# Altium project Flight_Controller.PrjPcb
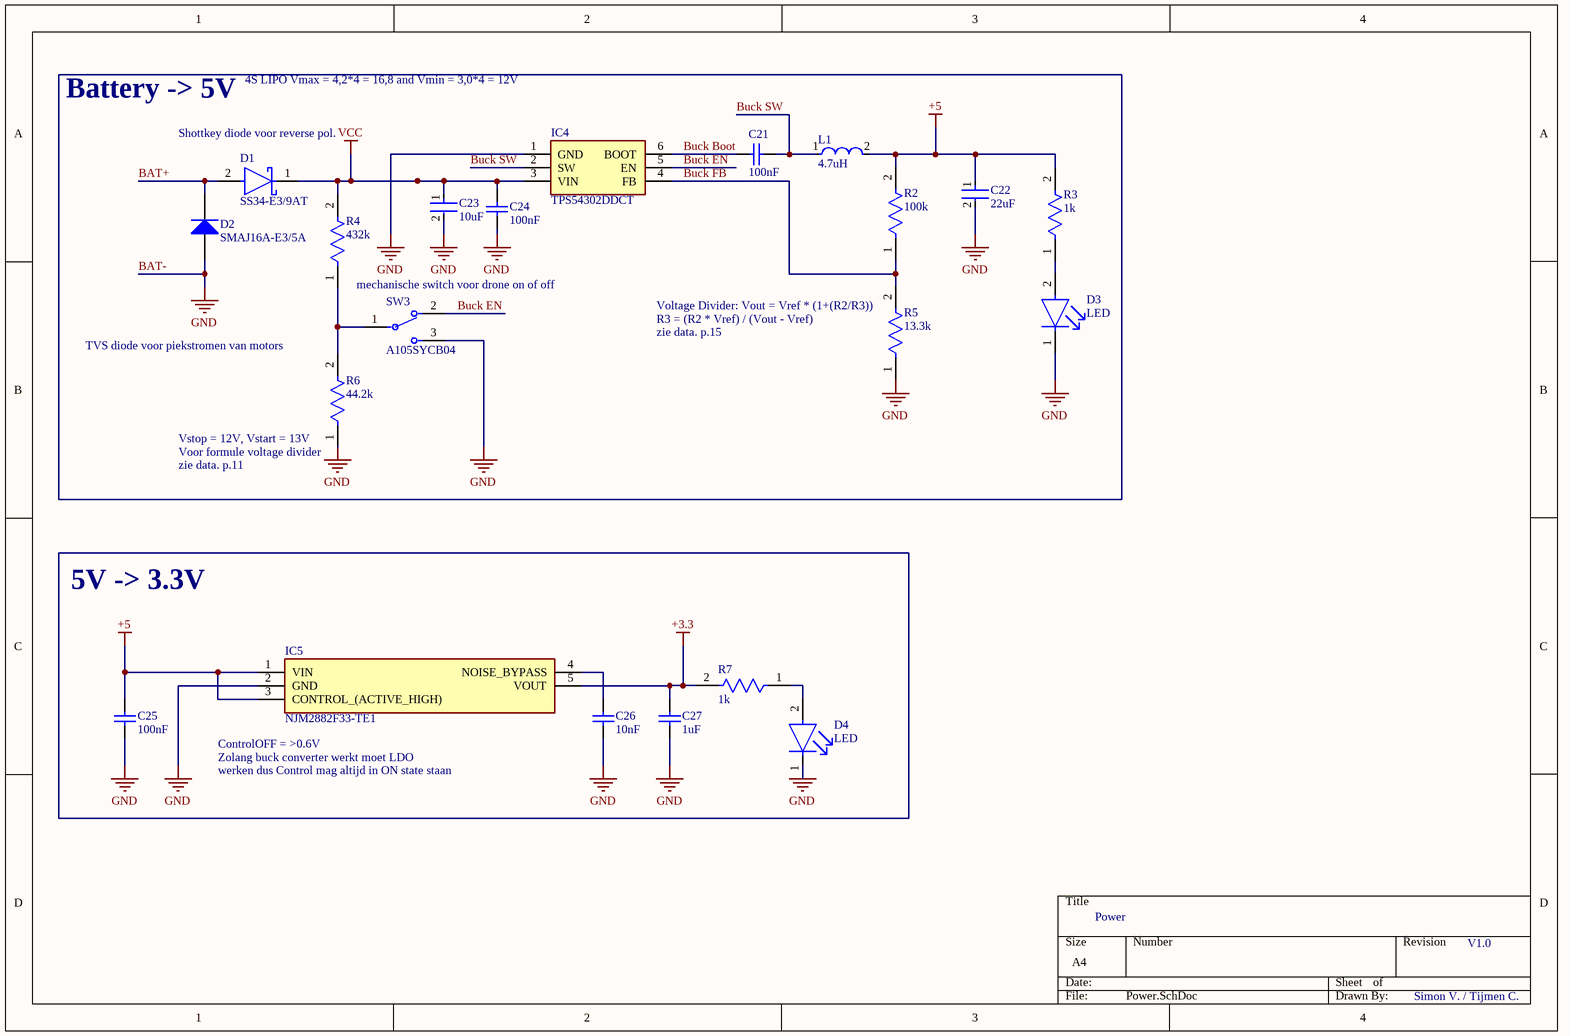
[diagram p0: Power.SchDoc]
5 sheets, 64 parts. Net scope: hierarchical (ports join the sheet entries above them; power ports are global).
Sheets:
  Power.SchDoc
  Root.SchDoc
    U_uController = uController.SchDoc
    U_High Freq = High Freq.SchDoc
    U_Sensors = Sensors.SchDoc

## Sheet Power.SchDoc
size A4; SheetNumber: 1; SheetTotal: 5

### Parts
C21  100nF  [CAPC1608X92X38ML15T08]
C22  22uF  [FP-GRM188-0_2-IPC_A]
C23  10uF  [FP-ZRB18AR61E106ME01L-MFG]
C24  100nF  [CAPC1608X92X38ML15T08]
C25  100nF  [CAPC1608X92X38ML15T08]
C26  10nF  [CAPC1608X92X38LL15T08]
C27  1uF  [CAPC1608X90X35NL15T15]
D1  SS34-E3/9AT  [FP-SMC-MFG]
D2  SMAJ16A-E3/5A  [VISH-DO-214AC-2_M]
D3  LED  [FP-APHD1608LZGCK-MFG]
D4  LED  [FP-APHD1608LZGCK-MFG]
IC4  TPS54302DDCT  [SOT95P280X110-6N]
IC5  NJM2882F33-TE1  [SOT95P280X130-5N]
L1  4.7uH  [FP-IHLP-2020BZ-FP_1_905x2-MFG]
R2  100k  [FP-SR0603-MFG]
R3  1k  [FP-AC0603-IPC_B]
R4  432k  [FP-AC0603-MFG]
R5  13.3k  [FP-AF0603-IPC_A]
R6  44.2k  [FP-CRCW0603-HPe3-IPC_A]
R7  1k  [FP-AC0603-IPC_B]
SW3  A105SYCB04  [FP-A105SYCB04-MFG]

### Nets
+3.3: C27.2 IC5.5(VOUT) R7.2
+5: C22.1 C25.2 IC5.1(VIN) IC5.3(CONTROL_(ACTIVE_HIGH)) L1.2 R2.2 R3.2
BAT-: C22.2 C23.2 C24.1 C25.1 C26.1 C27.1 D2.2(A) D3.1(C) D4.1(C) IC4.1(GND) IC5.2(GND) R5.1 R6.1 SW3.3  [also labelled GND]
VCC: C23.1 C24.2 D1.1(C) IC4.3(VIN) R4.2
BAT+: D1.2(A) D2.1(K)
Buck Boot: C21.2 IC4.6(BOOT)
Buck EN: IC4.5(EN) SW3.2
Buck FB: IC4.4(FB) R2.1 R5.2
Buck SW: C21.1 IC4.2(SW) L1.1
NetC26_2: C26.2 IC5.4(NOISE_BYPASS)
NetD3_2: D3.2(A) R3.1
NetD4_2: D4.2(A) R7.1
NetR4_1: R4.1 R6.2 SW3.1

### Notes on the sheet
- Battery -> 5V
- 4S LIPO Vmax = 4,2*4 = 16,8 and Vmin = 3,0*4 = 12V
- (near D1) Shottkey diode voor reverse pol.
- mechanische switch voor drone on of off
- (near R5) Voltage Divider: Vout = Vref * (1+(R2/R3))
- (near R6) TVS diode voor piekstromen van motors
- zie data. p.15
- (near R5) R3 = (R2 * Vref) / (Vout - Vref)
- (near R6) Vstop = 12V, Vstart = 13V
- (near R6) Voor formule voltage divider
- zie data. p.11
- 5V -> 3.3V
- (near IC5) ControlOFF = >0.6V
- (near IC5) Zolang buck converter werkt moet LDO
- werken dus Control mag altijd in ON state staan
- Power
- V1.0
- Simon V. / Tijmen C.

### Library data of the parts
C21 C24 C25 = CMP-2006-01140-1: Part Number: VJ0603Y104MXXAC; Manufacturer: Vitramon
C22 = CMP-06035-063651-1: Multilayer Ceramic Capacitor 22uF 20% 16V X5R 0603 Paper T/R
C23 = CMP-06035-062385-2: CAP CER 10UF 25V X5R 0603; Tolerance: 20%; Min Operating Temperature: -55°C; Voltage: 25V; Case Code (Imperial): 0603; Case Code (Metric): 1608; Voltage Rating (DC): 25V; Max Operating Temperature: 85°C; Depth: 0.8mm; Thickness: 0.047inch; RoHS Compliant: Yes; Dielectric: X5R; Mount: Surface Mount; Voltage Rating: 25V; Length: 0.063inch; Height: 1mm; Packaging: Cut Tape; Capacitance: 10uF; REACH SVHC: No SVHC; Width: 0.031inch; Case/Package: 0603
C26 = CMP-2006-01201-1: Manufacturer: Vitramon; Part Number: VJ0603Y103JXXAC
C27 = CMP-2006-04534-1: Part Number: 0603YD105MAT2A; Manufacturer: AVX Interconnect / Elco
D1 = CMP-02539-000066-1: DIODE SCHOTTKY 40V 3A DO214AB; Peak Non-Repetitive Surge Current: 100A; Forward Voltage: 500mV; Element Configuration: Single; Max Reverse Current: 500uA; Case/Package: SMC; Radiation Hardening: No; Series: -; Max Surge Current: 100A; RoHS Compliant: Yes; Min Operating Temperature: -55°C; Average Rectified Current: 3A; Max Reverse Leakage Current: 500uA; Package Quantity: 3500; Max Reverse Voltage (DC): 40V; Forward Current: 3A; Packaging: Tape and Reel; Max Operating Temperature: 125°C; Max Repetitive Reverse Voltage (Vrrm): 40V; Number of Pins: 2; Mount: Surface Mount
D2 = CMP-0548-00305-2: Transient Voltage Suppressor, 6.40 to 231 V, 16 V Stand-off Voltage, Uni-Directional, -55 to 155 degC, 2-pin DO-214AC, Pb-Free, Tape and Reel; Manufacturer: Vishay Semiconductor; VWM (V): 16; ID (uA): 1; PPPM (W): 400, 300; VBR Uni-Directional (V): 6.4 to 231; IFSM: 40 A; PackageReference: DO-214AC-2; ComponentLink2Description: Datasheet; Operating Junction and Storage Temperature Range: -55 to 150 degC; PackageDescription: 2-Pin DO-214AC (SMA), Body 4.245 x 2.665 mm; Packing: Tape and Reel; DatasheetVersion: 12/8/2013; ComponentLink1URL: http://www.vishay.com/; Mounting Technology: Surface Mount; RoHS: TRUE; ComponentLink1Description: Manufacturer URL; ComponentLink2URL: http://www.vishay.com/docs/88390/smaj50a.pdf; ComponentLink3Description: Package Specification; PartNumber: SMAJ16A-E3/5A; ComponentLink3URL: http://www.vishay.com/docs/88390/smaj50a.pdf
D3 D4 = CMP-44529-000045-1: LED GREEN CLEAR 1608 SMD, type: APHD1608LZGCK; Test Current: 2mA; Dominant Wavelength: 525nm; Lens Color: Colorless; Luminous Intensity: 180mcd; Viewing Angle: 100°; Forward Voltage: 2.65V; Lens Size: 0.7mm; Lens Style: Round; Mount: Surface Mount; Packaging: Tape and Reel; Lens Transparency: Clear; Height: 0.75mm; Case/Package: 0603; Length: 1.6mm; Case Code (Metric): 1608; Width: 0.8mm; Color: Green; Case Code (Imperial): 0603
IC4 = TPS54302DDCT: Integrated Circuit; Manufacturer_Name: Texas Instruments; Datasheet Link: https://componentsearchengine.com/Datasheets/2/TPS54302DDCT.pdf; Height: 1.1mm; Manufacturer_Part_Number: TPS54302DDCT; Mouser Part Number: 595-TPS54302DDCT; Mouser Price/Stock: https://www.mouser.co.uk/ProductDetail/Texas-Instruments/TPS54302DDCT?qs=zEmsApcVOkXGTx6CMk2KtQ%3D%3D; Arrow Part Number: TPS54302DDCT; Arrow Price/Stock: https://www.arrow.com/en/products/tps54302ddct/texas-instruments?utm_currency=USD&region=nac
IC5 = NJM2882F33-TE1: Integrated Circuit; Manufacturer_Name: New Japan Radio; Datasheet Link: https://datasheet.datasheetarchive.com/originals/distributors/Datasheets_SAMA/4727f49f1a6595e3af9a467a77f12495.pdf; Height: 1.3mm; Manufacturer_Part_Number: NJM2882F33-TE1; Mouser Part Number: 513-NJM2882F33-TE1; Mouser Price/Stock: https://www.mouser.co.uk/ProductDetail/NJR/NJM2882F33-TE1?qs=A8FRqtAK7u9DuEIVjsUa8Q%3D%3D
L1 = CMP-02424-000137-1: Fixed Inductors Commercial High Saturation Series 4.7uH 2.8A 116.6mΩ 20%; Self Resonant Frequency: 28MHz; Test Frequency: 100kHz; Shielding: Shielded; Core Material: Metal; DC Resistance (DCR): 116.6mR; Max DC Current: 3A; Saturation Current: 5A; Radiation Hardening: No; Inductance: 4.7uH; Width: 0.204inch; Packaging: Tape and Reel; Height - Seated (Max): 0.079inch; Height: 2mm; Tolerance: 20%; RMS Current (Irms): 2.8A; Mount: Surface Mount; Military Standard: Not; Termination: SMD/SMT; Min Operating Temperature: -55°C; Max Operating Temperature: 125°C; Case/Package: 2020; Depth: 5.43mm; Package Quantity: 2000; Current Rating: 2.8A; Length: 5.49mm; Inductance Tolerance: 20%
R2 = CMP-03412-000894-1: RES SMD 0603 1/4W 1% 100K OHM; Manufacturer Part Number: SR0603FR-7T100KL; Manufacturer: Yageo; Tolerance: 0.01; Voltage Rating: 75V; Value: 100KΩ; Power Rating: 0.25W; Automotive Grade: Grade 0; Ipc Land Pattern Name: RESC16080X45; Digikey Description: RES SMD 0603 1/4W 1% 100K OHM; Device Class L3: Chip SMD Resistors; Octopart: https://octopart.com/sr0603fr-7t100kl-yageo-91478071; Lead Free: Yes; RoHS: TRUE; Series: SR; Device Class L1: Passive Components; ComponentLink2URL: http://www.yageo.com/documents/recent/PYu-SR_D_F%20tol_RoHS_L_3.pdf; ComponentLink2Description: Datasheet; Automotive: Yes; Category: Res; Temperature Range High: +155°C; Height: 0.55mm; Composition: Thick Film; Resistance: 100KΩ; Temperature Range Low: -55°C; Footprint Url: http://www.yageo.com/exep/pages/download/literatures/PYu-R_Mount_10.pdf; Device Class L2: Resistors; Temperature: -55°C to +155°C; Package: SR0603
R3 R7 = CMP-03412-047577-1: RES 1kΩ 1.00% 0.2W 0603
R4 = CMP-03412-010825-2: RES 432KΩ 1.00% 0.1W 0603; Resistance: 432kR; Temperature Coefficient: 100ppm/°C; Tolerance: 1%; Max Power Dissipation: 100mW; Voltage Rating: 50V; Case Code (Imperial): 0603; Max Operating Temperature: 155°C; Packaging: Tape and Reel; Case/Package: 0603; Min Operating Temperature: -55°C; Height: 0.022inch; Width: 0.8mm; Number of Terminations: 2; Resistor Type: Thick Film; Series: AC; Features: Moisture Resistant; Case Code (Metric): 1608; Length: 0.063inch; Power Rating: 100mW; RoHS Compliant: Yes; Termination: SMD/SMT
R5 = CMP-03412-046877-1: Anti-Sulfurated Chip Resistors Automotive Grade 13.3kΩ 1% 100ppm/°C 0603; Resistance: 13.3kR; Max Power Dissipation: 100mW; Resistor Type: Thick Film; Min Operating Temperature: -55°C; Number of Terminations: 2; Temperature Coefficient: 100ppm/°C; Height: 0.022inch; Case/Package: 0603; Max Operating Temperature: 155°C; Series: AF; Tolerance: 1%; Length: 0.063inch; RoHS Compliant: Yes; Packaging: Tape and Reel; Width: 0.031inch; Features: Moisture Resistant
R6 = CMP-02407-008692-1: RES Thick Film, 44.2kΩ, 1%, 0.33W, 100ppm/°C, 0603; Resistance: 44.2kR; Max Power Dissipation: 250mW; Length: 0.063inch; Contact Plating: Tin; Height: 0.022inch; Composition: Thick Film; Temperature Coefficient: 100ppm/°C; Termination: Wraparound; Mount: Surface Mount; Package Quantity: 5000; Lead Free: Lead Free; Case/Package: 0603; Width: 0.033inch; Packaging: Tape and Reel; Power Rating: 250mW; Max Operating Temperature: 155°C; Number of Terminations: 2; Features: Automotive AEC-Q200; Tolerance: 1%; Min Operating Temperature: -55°C
SW3 = CMP-03408-000016-1: SWITCH TOGGLE SPDT 0.4VA 20V; Power Rating: 400mW; Insulation Resistance: 30MR; Actuator Length: 10.41mm; Illumination Type: Illuminated; Contact Resistance: 10mR; Contact Current Rating: 400mA; Actuator Material: Phenolic; Contact Material: Copper; Termination: Solder; Throw Configuration: SPDT; Contact Plating: Gold; REACH SVHC: No SVHC; Series: Gemini A; Mount: Bushing; Package Quantity: 100; Voltage Rating (AC): 20V; Min Operating Temperature: -30°C; Max Voltage Rating (DC): 20V; Max Operating Temperature: 85°C; Flammability Rating: UL94 V-0; RoHS Compliant: Yes

## Sheet Root.SchDoc
size A4; SheetNumber: 2; SheetTotal: 6
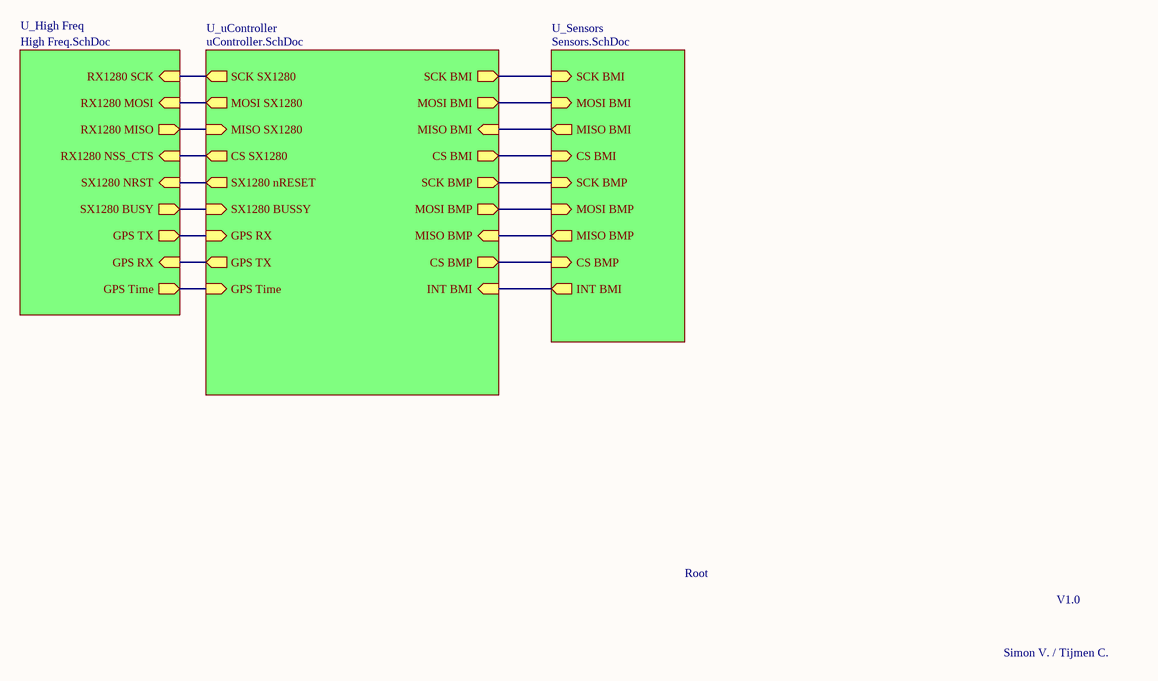
[diagram p1: Root.SchDoc]

### Sub-sheets
U_High Freq = High Freq.SchDoc: SX1280 BUSY (out), SX1280 NRST (in), RX1280 MISO (out), RX1280 MOSI (in), RX1280 SCK (in), RX1280 NSS_CTS (in), GPS RX (in), GPS TX (out), GPS Time (out)
U_Sensors = Sensors.SchDoc: MOSI BMI (in), SCK BMI (in), CS BMI (in), MISO BMI (out), MOSI BMP (in), SCK BMP (in), CS BMP (in), MISO BMP (out), INT BMI (out)
U_uController = uController.SchDoc: CS BMI (out), CS SX1280 (out), MISO BMI (in), MISO SX1280 (in), MOSI BMI (out), MOSI SX1280 (out), SCK BMI (out), SCK SX1280 (out), CS BMP (out), MISO BMP (in), MOSI BMP (out), SCK BMP (out), GPS Time (in), SX1280 nRESET (out), SX1280 BUSSY (in), GPS RX (in), GPS TX (out), INT BMI (in)

### Nets
CS BMI: sheet U_uController/CS BMI, sheet U_Sensors/CS BMI
CS BMP: sheet U_uController/CS BMP, sheet U_Sensors/CS BMP
CS SX1280: sheet U_uController/CS SX1280, sheet U_High Freq/RX1280 NSS_CTS
DAN-F10N RX: sheet U_uController/GPS TX, sheet U_High Freq/GPS RX
DAN-F10N TX: sheet U_uController/GPS RX, sheet U_High Freq/GPS TX
GPS Time: sheet U_uController/GPS Time, sheet U_High Freq/GPS Time
INT BMI: sheet U_uController/INT BMI, sheet U_Sensors/INT BMI
MISO BMI: sheet U_uController/MISO BMI, sheet U_Sensors/MISO BMI
MISO BMP: sheet U_uController/MISO BMP, sheet U_Sensors/MISO BMP
MISO SX1280: sheet U_uController/MISO SX1280, sheet U_High Freq/RX1280 MISO
MOSI BMI: sheet U_uController/MOSI BMI, sheet U_Sensors/MOSI BMI
MOSI BMP: sheet U_uController/MOSI BMP, sheet U_Sensors/MOSI BMP
MOSI SX1280: sheet U_uController/MOSI SX1280, sheet U_High Freq/RX1280 MOSI
RX1280 SCK: sheet U_uController/SCK SX1280, sheet U_High Freq/RX1280 SCK
SCK BMI: sheet U_uController/SCK BMI, sheet U_Sensors/SCK BMI
SCK BMP: sheet U_uController/SCK BMP, sheet U_Sensors/SCK BMP
SX1280 BUSSY: sheet U_uController/SX1280 BUSSY, sheet U_High Freq/SX1280 BUSY
SX1280 nReset: sheet U_uController/SX1280 nRESET, sheet U_High Freq/SX1280 NRST

### Notes on the sheet
- Root
- V1.0
- Simon V. / Tijmen C.

## Sheet uController.SchDoc
size A3; SheetNumber: 3; SheetTotal: 5
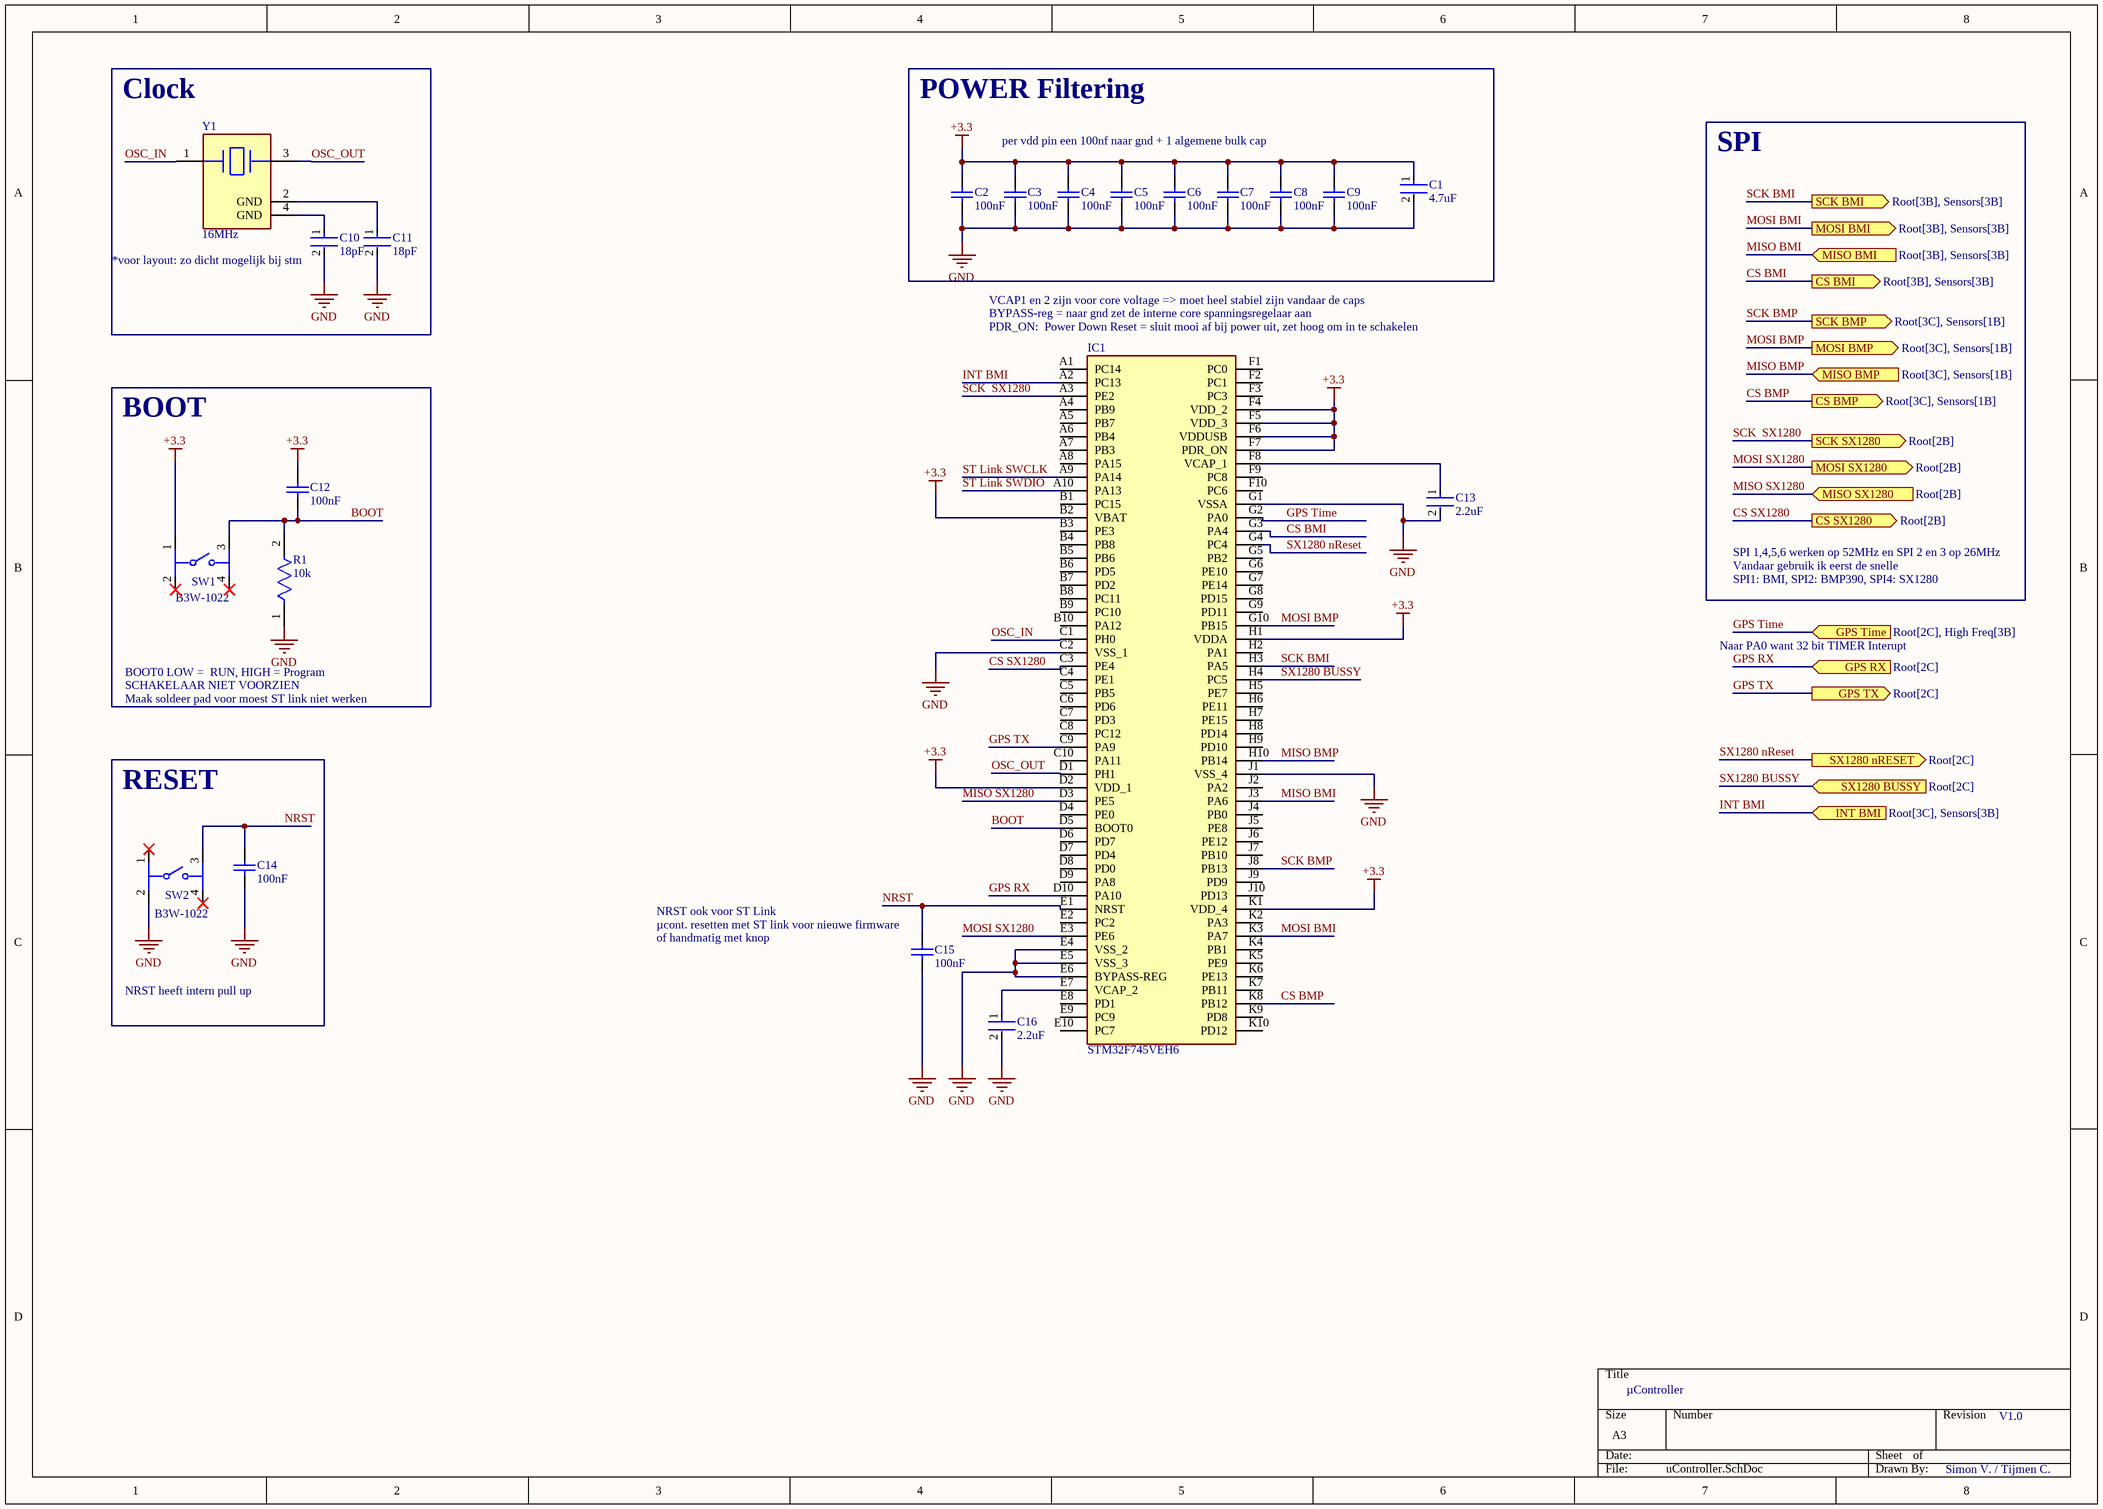
[diagram p2: uController.SchDoc]

### Parts
C1  4.7uF  [FP-CC0603-DC-MFG]
C2  100nF  [CAPC1608X92X38ML15T08]
C3  100nF  [CAPC1608X92X38ML15T08]
C4  100nF  [CAPC1608X92X38ML15T08]
C5  100nF  [CAPC1608X92X38ML15T08]
C6  100nF  [CAPC1608X92X38ML15T08]
C7  100nF  [CAPC1608X92X38ML15T08]
C8  100nF  [CAPC1608X92X38ML15T08]
C9  100nF  [CAPC1608X92X38ML15T08]
C10  18pF  [FP-C0603C-CF-MFG]
C11  18pF  [FP-C0603C-CF-MFG]
C12  100nF  [CAPC1608X92X38ML15T08]
C13  2.2uF  [FP-CC0603-DA-MFG]
C14  100nF  [CAPC1608X92X38ML15T08]
C15  100nF  [CAPC1608X92X38ML15T08]
C16  2.2uF  [FP-CC0603-DA-MFG]
IC1  STM32F745VEH6  [BGA100C80P10X10_800X800X110]
R1  10k  [FP-MCT0603-MFG]
SW1  B3W-1022  [FP-B3W-1022-MFG]
SW2  B3W-1022  [FP-B3W-1022-MFG]
Y1  16MHz  [FP-ABM8-MFG]

### Ports
CS BMI (out, see Root[3B], Sensors[3B]), CS BMP (out, see Root[3C], Sensors[1B]), CS SX1280 (out, see Root[2B]), GPS RX (in, see Root[2C]), GPS Time (in, see Root[2C], High Freq[3B]), GPS TX (out, see Root[2C]), INT BMI (in, see Root[3C], Sensors[3B]), MISO BMI (in, see Root[3B], Sensors[3B]), MISO BMP (in, see Root[3C], Sensors[1B]), MISO SX1280 (in, see Root[2B]), MOSI BMI (out, see Root[3B], Sensors[3B]), MOSI BMP (out, see Root[3C], Sensors[1B]), MOSI SX1280 (out, see Root[2B]), SCK BMI (out, see Root[3B], Sensors[3B]), SCK BMP (out, see Root[3C], Sensors[1B]), SCK SX1280 (out, see Root[2B]), SX1280 BUSSY (in, see Root[2C]), SX1280 nRESET (out, see Root[2C])

### Nets
+3.3: C1.1 C2.2 C3.2 C4.2 C5.2 C6.2 C7.2 C8.2 C9.2 C12.2 IC1.B2(VBAT) IC1.D2(VDD_1) IC1.F4(VDD_2) IC1.F5(VDD_3) IC1.F6(VDDUSB) IC1.F7(PDR_ON) IC1.H1(VDDA) IC1.K1(VDD_4) SW1.1
GND: C1.2 C2.1 C3.1 C4.1 C5.1 C6.1 C7.1 C8.1 C9.1 C10.2 C11.2 C13.2 C14.1 C15.1 C16.2 IC1.C2(VSS_1) IC1.E4(VSS_2) IC1.E5(VSS_3) IC1.E6(BYPASS-REG) IC1.G1(VSSA) IC1.J1(VSS_4) R1.1 SW2.2  [project net BAT-]
BOOT: C12.1 IC1.D5(BOOT0) R1.2 SW1.3
CS BMI: IC1.G3(PA4) ; port CS BMI
CS BMP: IC1.K8(PB12) ; port CS BMP
CS SX1280: IC1.C3(PE4) ; port CS SX1280
GPS RX: IC1.D10(PA10) ; port GPS RX  [project net DAN-F10N TX]
GPS Time: IC1.G2(PA0) ; port GPS Time
GPS TX: IC1.C9(PA9) ; port GPS TX  [project net DAN-F10N RX]
INT BMI: IC1.A2(PC13) ; port INT BMI
MISO BMI: IC1.J3(PA6) ; port MISO BMI
MISO BMP: IC1.H10(PB14) ; port MISO BMP
MISO SX1280: IC1.D3(PE5) ; port MISO SX1280
MOSI BMI: IC1.K3(PA7) ; port MOSI BMI
MOSI BMP: IC1.G10(PB15) ; port MOSI BMP
MOSI SX1280: IC1.E3(PE6) ; port MOSI SX1280
NRST: C14.2 C15.2 IC1.E1(NRST) SW2.3
OSC_IN: IC1.C1(PH0) Y1.1
OSC_OUT: IC1.D1(PH1) Y1.3
SCK  SX1280: IC1.A3(PE2) ; port SCK SX1280  [project net RX1280 SCK]
SCK BMI: IC1.H3(PA5) ; port SCK BMI
SCK BMP: IC1.J8(PB13) ; port SCK BMP
ST Link SWCLK: IC1.A9(PA14)
ST Link SWDIO: IC1.A10(PA13)
SX1280 BUSSY: IC1.H4(PC5) ; port SX1280 BUSSY
SX1280 nReset: IC1.G4(PC4) ; port SX1280 nRESET
NetC10_1: C10.1 Y1.4(GND)
NetC11_1: C11.1 Y1.2(GND)
NetC13_1: C13.1 IC1.F8(VCAP_1)
NetC16_1: C16.1 IC1.E7(VCAP_2)

Not connected (* = marked no-connect by the designer): IC1 A1(PC14) A4(PB9) A5(PB7) A6(PB4) A7(PB3) A8(PA15) B1(PC15) B3(PE3) B4(PB8) B5(PB6) B6(PD5) B7(PD2) B8(PC11) B9(PC10) B10(PA12) C4(PE1) C5(PB5) C6(PD6) C7(PD3) C8(PC12) C10(PA11) D4(PE0) D6(PD7) D7(PD4) D8(PD0) D9(PA8) E2(PC2) E8(PD1) E9(PC9) E10(PC7) F1(PC0) F2(PC1) F3(PC3) F9(PC8) F10(PC6) G5(PB2) G6(PE10) G7(PE14) G8(PD15) G9(PD11) H2(PA1) H5(PE7) H6(PE11) H7(PE15) H8(PD14) H9(PD10) J2(PA2) J4(PB0) J5(PE8) J6(PE12) J7(PB10) J9(PD9) J10(PD13) K2(PA3) K4(PB1) K5(PE9) K6(PE13) K7(PB11) K9(PD8) K10(PD12); SW1 2* 4*; SW2 1* 4*

### Notes on the sheet
- Clock
- POWER Filtering
- per vdd pin een 100nf naar gnd + 1 algemene bulk cap
- SPI
- (near C10) *voor layout: zo dicht mogelijk bij stm
- VCAP1 en 2 zijn voor core voltage => moet heel stabiel zijn vandaar de caps
- (near IC1) BYPASS-reg = naar gnd zet de interne core spanningsregelaar aan
- (near IC1) PDR_ON:  Power Down Reset = sluit mooi af bij power uit, zet hoog om in te schakelen
- BOOT
- SPI 1,4,5,6 werken op 52MHz en SPI 2 en 3 op 26MHz
- Vandaar gebruik ik eerst de snelle
- SPI1: BMI, SPI2: BMP390, SPI4: SX1280
- Naar PA0 want 32 bit TIMER Interupt
- BOOT0 LOW =  RUN, HIGH = Program
- SCHAKELAAR NIET VOORZIEN
- Maak soldeer pad voor moest ST link niet werken
- RESET
- NRST ook voor ST Link
- (near C15) µcont. resetten met ST link voor nieuwe firmware
- of handmatig met knop
- NRST heeft intern pull up
- µController
- V1.0
- Simon V. / Tijmen C.

### Library data of the parts
C1 = CMP-03422-001038-2: CAP CER 4.7UF 6.3V X7R 0603; Tolerance: 20%; RoHS Compliant: Yes; Packaging: Cut Tape; Mount: Surface Mount; Case Code (Imperial): 0603; Voltage Rating: 6.3V; Min Operating Temperature: -55°C; Case/Package: 0603; Case Code (Metric): 1608; Max Operating Temperature: 125°C; Capacitance: 4.7uF
C2-C9 C12 C14 C15 = CMP-2006-01140-1: as C21 on sheet Power
C10 C11 = CMP-03020-018448-1: C0603 18 pF C0G 30ppm/°C 1.00% 50 V; Manufacturer: KEMET; Manufacturer Part Number: C0603C180F5GACAUTO; Voltage Rating: 50 V; Automotive Grade: Grade 1; Tolerance: 0.01; Material: Ceramic; Height: 0.87mm; Lead Free: Yes; Category: Cap; Capacitance: 18 pF; Temperature Characteristic: C0G; Device Class L3: Ceramic Capacitors; Package: C0603C-CF; ComponentLink2Description: Datasheet; Automotive: Yes; Temperature Range Low: -55°C; Device Class L1: Passive Components; ComponentLink2URL: https://api.kemet.com/component-edge/download/datasheet/C0603C100J5GACAUTO.pdf; Octopart: https://octopart.com/c0603c180f5gacauto-kemet-91893831; Value: 18 pF; Temperature: -55°C to +125°C; Temperature Range High: +125°C; Device Class L2: Capacitors; RoHS: TRUE; Temperature Coefficient: 30ppm/°C
C13 C16 = CMP-03422-000187-1: CC0603 2.2 uF X5R 10.00% 16 V; Manufacturer: YAGEO; Manufacturer Part Number: CC0603KPX5R7BB225; Voltage Rating: 16 V; Material: Ceramic; Tolerance: 0.1; Temperature Coefficient: 15%; ComponentLink2Description: Datasheet; Device Class L3: Ceramic Capacitors; Temperature Characteristic: X5R; Package: CC0603-DA; Automotive: No; Device Class L1: Passive Components; ComponentLink2URL: http://www.yageo.com/documents/recent/UPY-GPHC_X7R_6.3V-to-50V_18.pdf; Value: 2.2 uF; RoHS: TRUE; Height: 0.9mm; Temperature Range High: +125°C; Footprint Url: http://www.yageo.com/exep/pages/download/literatures/UPY-C_GEN_24.pdf; Lead Free: Yes; Temperature Range Low: -55°C; Capacitance: 2.2 uF; Octopart: https://octopart.com/cc0603kpx5r7bb225-yageo-91091799; Device Class L2: Capacitors; Voltage: 16 V; Temperature: -55°C to +125°C; Category: Cap
IC1 = STM32F745VEH6: Integrated Circuit; Manufacturer_Name: STMicroelectronics; Datasheet Link: https://www.st.com/resource/en/datasheet/stm32f745ie.pdf; Height: 1.1mm; Manufacturer_Part_Number: STM32F745VEH6; Mouser Part Number: 511-STM32F745VEH6; Mouser Price/Stock: https://www.mouser.co.uk/ProductDetail/STMicroelectronics/STM32F745VEH6?qs=dTJS0cRn7ogJy7Gdq90%252Bbw%3D%3D; Arrow Part Number: STM32F745VEH6; Arrow Price/Stock: https://www.arrow.com/en/products/stm32f745veh6/stmicroelectronics?region=nac
R1 = CMP-02407-002367-1: RES SMD 100 OHM 1% 1/8W 0603; Max Power Dissipation: 100mW; Temperature Coefficient: 15ppm/°C; Resistance: 10kR; Tolerance: 0.1%; Length: 0.061inch; Min Operating Temperature: -55°C; Case/Package: 0603; Max Operating Temperature: 125°C; Number of Terminations: 2; Packaging: Tape and Reel; Width: 0.033inch; Composition: Thin Film; Height: 0.022inch; Package Quantity: 1000
SW1 SW2 = CMP-08834-000055-1: SWITCH TACTILE SPST-NO 0.05A 24V; Operating Force: 230gf; Switch Function: Off-Mom; Switch Travel: 0.25mm; Throw Configuration: SPST; Actuator Type: Standard; Illumination Type: Non-Illuminated; Ratings: IP67; Mechanical Life: 1000000Cycles; Packaging: Bulk; Termination: PC Pin; Max Operating Temperature: 70°C; RoHS Compliant: Yes; Mount: Through Hole; Min Operating Temperature: -25°C
Y1 = CMP-27762-003067-1: Crystal 16MHz ±20ppm 18pF SMD-4 3.2mm x 2.5mm                      ABM8-16.000MHZ-B2-T3; Frequency Stability: 50ppm; ESR (Equivalent Series Resistance): 70R; Packaging: Tape and Reel; Load Capacitance: 18pF; Min Operating Temperature: -20°C; Case/Package: SMD/SMT; Length: 0.126inch; RoHS Compliant: Yes; Max Operating Temperature: 70°C; Width: 0.098inch; Series: ABM8; Frequency: 16MHz; Height: 0.031inch; Mount: Surface Mount; Frequency Tolerance: 20ppm

## Sheet High Freq.SchDoc
size A4; SheetNumber: 5; SheetTotal: 5
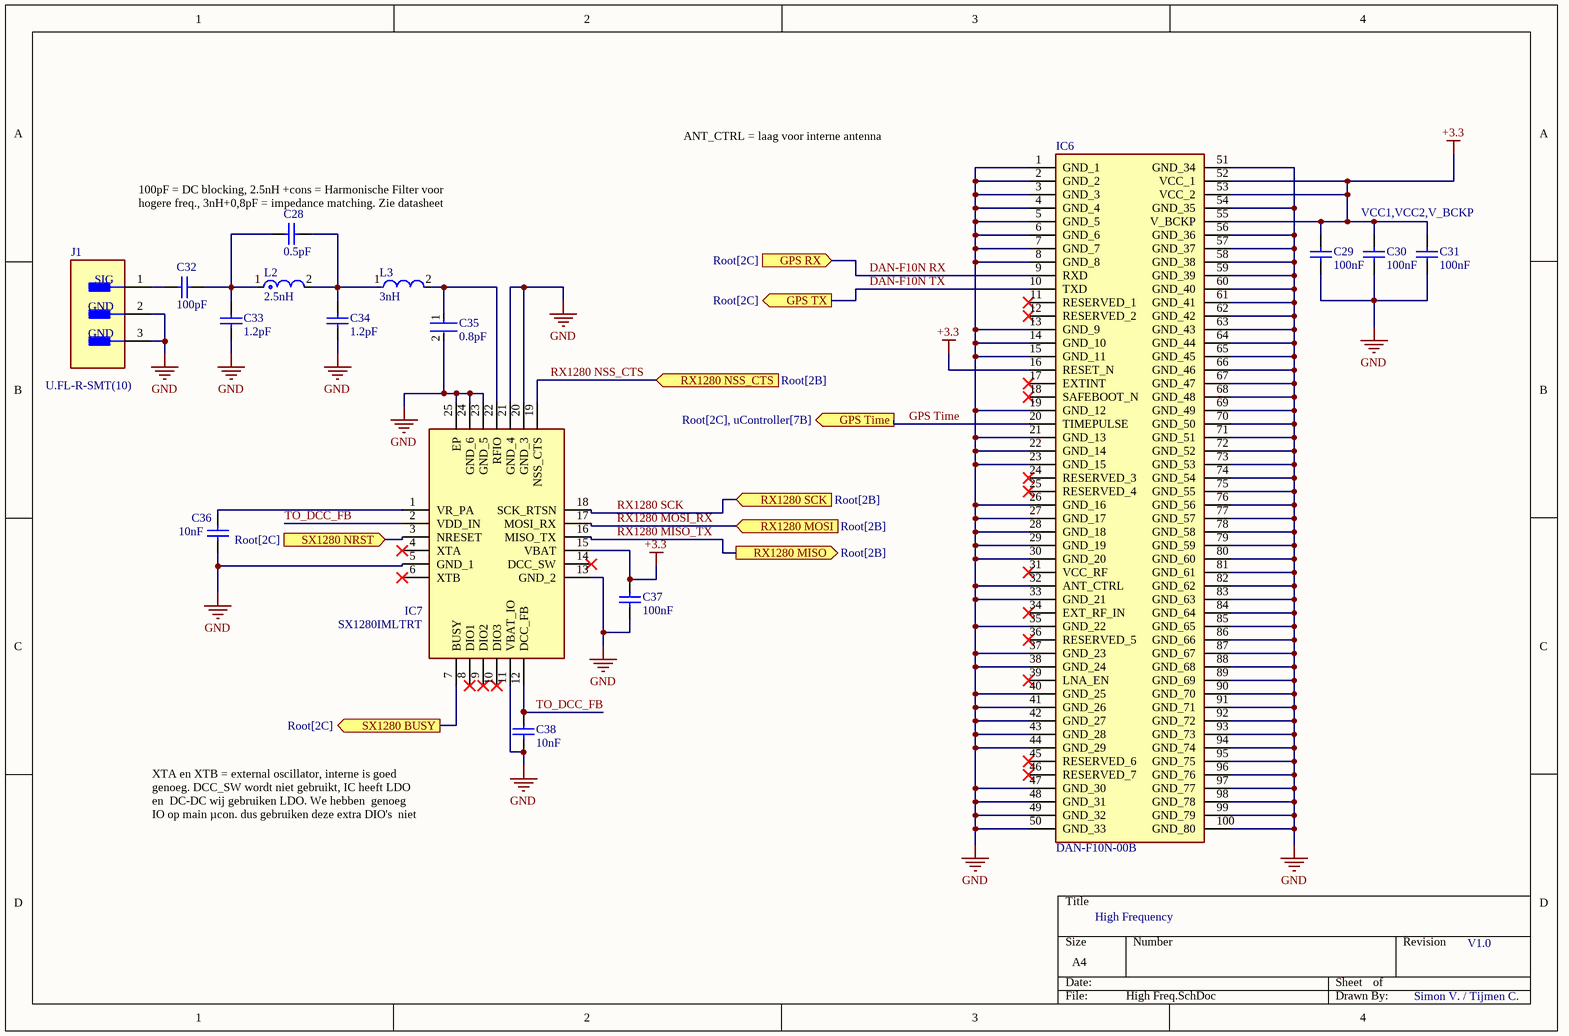
[diagram p3: High Freq.SchDoc]

### Parts
C28  0.5pF  [CAPC0603(1608)100_M]
C29  100nF  [CAPC1608X92X38ML15T08]
C30  100nF  [CAPC1608X92X38ML15T08]
C31  100nF  [CAPC1608X92X38ML15T08]
C32  100pF  [CAPC1608X92X38NL15T08]
C33  1.2pF  [CAPC1608X90X35NL15T15]
C34  1.2pF  [CAPC1608X90X35NL15T15]
C35  0.8pF  [FP-GCM188-0_1-IPC_C]
C36  10nF  [CAPC1608X92X38LL15T08]
C37  100nF  [CAPC1608X92X38ML15T08]
C38  10nF  [CAPC1608X92X38LL15T08]
IC6  DAN-F10N-00B  [DANF10N00B]
IC7  SX1280IMLTRT  [QFN50P400X400X100-25N-D]
J1  U.FL-R-SMT(10)  [FP-U_FL-R-SMT_10-MFG]
L2  2.5nH  [FP-LQP03TG_02-IPC_A]
L3  3nH  [FP-LQW18AN_80-MFG]

### Ports
GPS RX (in, see Root[2C]), GPS Time (out, see Root[2C], uController[7B]), GPS TX (out, see Root[2C]), RX1280 MISO (out, see Root[2B]), RX1280 MOSI (in, see Root[2B]), RX1280 NSS_CTS (in, see Root[2B]), RX1280 SCK (in, see Root[2B]), SX1280 BUSY (out, see Root[2C]), SX1280 NRST (in, see Root[2C])

### Nets
+3.3: C29.2 C30.2 C31.2 C37.2 IC6.16(RESET_N) IC6.52(VCC_1) IC6.53(VCC_2) IC6.55(V_BCKP) IC7.15(VBAT)
GND: C29.1 C30.1 C31.1 C33.1 C34.1 C35.2 C36.1 C37.1 C38.1 IC6.1(GND_1) IC6.2(GND_2) IC6.3(GND_3) IC6.4(GND_4) IC6.5(GND_5) IC6.6(GND_6) IC6.7(GND_7) IC6.8(GND_8) IC6.13(GND_9) IC6.14(GND_10) IC6.15(GND_11) IC6.19(GND_12) IC6.21(GND_13) IC6.22(GND_14) IC6.23(GND_15) IC6.26(GND_16) IC6.27(GND_17) IC6.28(GND_18) IC6.29(GND_19) IC6.30(GND_20) IC6.32(ANT_CTRL) IC6.33(GND_21) IC6.35(GND_22) IC6.37(GND_23) IC6.38(GND_24) IC6.40(GND_25) IC6.41(GND_26) IC6.42(GND_27) IC6.43(GND_28) IC6.44(GND_29) IC6.47(GND_30) IC6.48(GND_31) IC6.49(GND_32) IC6.50(GND_33) IC6.51(GND_34) IC6.54(GND_35) IC6.56(GND_36) IC6.57(GND_37) IC6.58(GND_38) IC6.59(GND_39) IC6.60(GND_40) IC6.61(GND_41) IC6.62(GND_42) IC6.63(GND_43) IC6.64(GND_44) IC6.65(GND_45) IC6.66(GND_46) IC6.67(GND_47) IC6.68(GND_48) IC6.69(GND_49) IC6.70(GND_50) IC6.71(GND_51) IC6.72(GND_52) IC6.73(GND_53) IC6.74(GND_54) IC6.75(GND_55) IC6.76(GND_56) IC6.77(GND_57) IC6.78(GND_58) IC6.79(GND_59) IC6.80(GND_60) IC6.81(GND_61) IC6.82(GND_62) IC6.83(GND_63) IC6.84(GND_64) IC6.85(GND_65) IC6.86(GND_66) IC6.87(GND_67) IC6.88(GND_68) IC6.89(GND_69) IC6.90(GND_70) IC6.91(GND_71) IC6.92(GND_72) IC6.93(GND_73) IC6.94(GND_74) IC6.95(GND_75) IC6.96(GND_76) IC6.97(GND_77) IC6.98(GND_78) IC6.99(GND_79) IC6.100(GND_80) IC7.5(GND_1) IC7.11(VBAT_IO) IC7.13(GND_2) IC7.20(GND_3) IC7.21(GND_4) IC7.23(GND_5) IC7.24(GND_6) IC7.25(EP) J1.2(GND) J1.3(GND)  [project net BAT-]
DAN-F10N RX: IC6.9(RXD) ; port GPS RX
DAN-F10N TX: IC6.10(TXD) ; port GPS TX
GPS Time: IC6.20(TIMEPULSE) ; port GPS Time
RX1280 MISO_TX: IC7.16(MISO_TX) ; port RX1280 MISO  [project net MISO SX1280]
RX1280 MOSI_RX: IC7.17(MOSI_RX) ; port RX1280 MOSI  [project net MOSI SX1280]
RX1280 NSS_CTS: IC7.19(NSS_CTS) ; port RX1280 NSS_CTS  [project net CS SX1280]
RX1280 SCK: IC7.18(SCK_RTSN) ; port RX1280 SCK
SX1280 BUSSY: IC7.7(BUSY) ; port SX1280 BUSY
SX1280 nReset: IC7.3(NRESET) ; port SX1280 NRST
TO_DCC_FB: C38.2 IC7.2(VDD_IN) IC7.12(DCC_FB)
NetC28_1: C28.1 C32.2 C33.2 L2.1
NetC28_2: C28.2 C34.2 L2.2 L3.1
NetC32_1: C32.1 J1.1(SIG)
NetC35_1: C35.1 IC7.22(RFIO) L3.2
NetC36_2: C36.2 IC7.1(VR_PA)

Not connected (* = marked no-connect by the designer): IC6 11(RESERVED_1)* 12(RESERVED_2)* 17(EXTINT)* 18(SAFEBOOT_N)* 24(RESERVED_3)* 25(RESERVED_4)* 31(VCC_RF)* 34(EXT_RF_IN)* 36(RESERVED_5)* 39(LNA_EN)* 45(RESERVED_6)* 46(RESERVED_7)*; IC7 4(XTA)* 6(XTB)* 8(DIO1)* 9(DIO2)* 10(DIO3)* 14(DCC_SW)*

### Notes on the sheet
- ANT_CTRL = laag voor interne antenna
- (near C28) 100pF = DC blocking, 2.5nH +cons = Harmonische Filter voor hogere freq., 3nH+0,8pF = impedance matching. Zie datasheet
- VCC1,VCC2,V_BCKP
- XTA en XTB = external oscillator, interne is goed genoeg. DCC_SW wordt niet gebruikt, IC heeft LDO en  DC-DC wij gebruiken LDO. We hebben  genoeg IO op main µcon. dus gebruiken deze extra DIO's  niet
- High Frequency
- V1.0
- Simon V. / Tijmen C.

### Library data of the parts
C28 = CMP-1035-00001-1: CAP 0.5pF 10V ±0.1pF 0603 (1608 Metric) Thickness 1mm SMD; Case-EIA: 0603; Case-Metric: 1608; Tolerance: Â±0.1pF; Max Thickness: 1 mm; Value: 0.5pF; Technology: SMT; Rated Voltage: 10 V
C29-C31 C37 = CMP-2006-01140-1: as C21 on sheet Power
C32 = CMP-2006-01145-1: Manufacturer: Vitramon; Part Number: VJ0603A101KXCAC
C33 C34 = CMP-2006-04009-1: Manufacturer: AVX Interconnect / Elco; Part Number: 06031A1R2CAT2A
C35 = CMP-06035-009191-1: Ceramic Capacitor for Automotive 0.8pF  ±0.1pF 100VDC C0G 0603 Paper T/R
C36 C38 = CMP-2006-01201-1: as C26 on sheet Power
IC6 = DAN-F10N-00B: Integrated Circuit; Manufacturer_Name: u-blox; Datasheet Link: https://content.u-blox.com/sites/default/files/documents/DAN-F10N_DataSheet_UBXDOC-963802114-13074.pdf; Height: 12.4mm; Manufacturer_Part_Number: DAN-F10N-00B
IC7 = SX1280IMLTRT: Integrated Circuit; Manufacturer_Name: SEMTECH; Datasheet Link: https://datasheet.datasheetarchive.com/originals/distributors/DKDS-37/728740.pdf; Height: 1mm; Manufacturer_Part_Number: SX1280IMLTRT; Mouser Part Number: 947-SX1280IMLTRT; Mouser Price/Stock: https://www.mouser.co.uk/ProductDetail/Semtech/SX1280IMLTRT?qs=5aG0NVq1C4xuoq8G6ZzdxQ%3D%3D; Arrow Part Number: SX1280IMLTRT; Arrow Price/Stock: https://www.arrow.com/en/products/sx1280imltrt/semtech?utm_currency=USD&region=nac
J1 = CMP-0029-00003-2: CONN U.FL RCPT STR 50 OHM SMD; Plating: Silver; Connector Type: Coaxial; Frequency: 6GHz; Impedance: 50R; Body Material: Bronze; Dielectric Material: Polymer; Contact Plating: Gold; Termination: Solder; Orientation: Vertical; Contact Material: Brass; Min Operating Temperature: -40°C; Mount: Surface Mount; Lead Free: Lead Free; Max Operating Temperature: 90°C; Radiation Hardening: No; Packaging: Tape and Reel; Body Plating: Silver; Fastening Type: Snap; Max Frequency: 6GHz; Depth: 3.1mm; Package Quantity: 1; Case/Package: SMD/SMT; Housing Color: Beige; Length: 3mm
L2 = CMP-06042-004686-1: Film type RF Inductor 2.5nH ±0.1nH 500mA 0.2Ω 0201 (0603); Self Resonant Frequency: 10GHz; Shielding: Unshielded; Core Material: Non-Magnetic; Test Frequency: 500MHz; Q Factor: 14; DC Resistance (DCR): 200mR; Package Quantity: 15000; Resistor Type: Thin Film; Max DC Current: 500mA; Lead Free: Lead Free; Packaging: Tape and Reel; Height - Seated (Max): 0.013inch; Inductance: 2.5nH; Width: 0.012inch; Termination: SMD/SMT; Case Code (Imperial): 0201; Mount: Surface Mount; Max Operating Temperature: 125°C; Height: 0.3mm; Min Operating Temperature: -55°C; Case Code (Metric): 0603; Length: 0.024inch; Current Rating: 500mA; Case/Package: 0201
L3 = CMP-06042-001485-1: Wire Wound RF Inductor 3nH ±0.2nH 670mA 0.17Ω 0603 (1608); Shielding: Unshielded; Core Material: Non-Magnetic; DC Resistance (DCR): 170mR; Self Resonant Frequency: 15GHz; Test Frequency: 100MHz; Q Factor: 13; Packaging: Tape and Reel; Case Code (Imperial): 0603; Case Code (Metric): 1608; Length: 0.065inch; Min Operating Temperature: -55°C; Height - Seated (Max): 0.039inch; Current Rating: 670mA; Case/Package: 0603; Resistor Type: Wirewound; Weight: 7.1E-05oz; Max Operating Temperature: 125°C; Max DC Current: 670mA; Package Quantity: 4000; Inductance: 3nH; Width: 0.99mm; Mount: Surface Mount; Height: 0.9mm; Termination: SMD/SMT

## Sheet Sensors.SchDoc
size A4; SheetNumber: 4; SheetTotal: 5
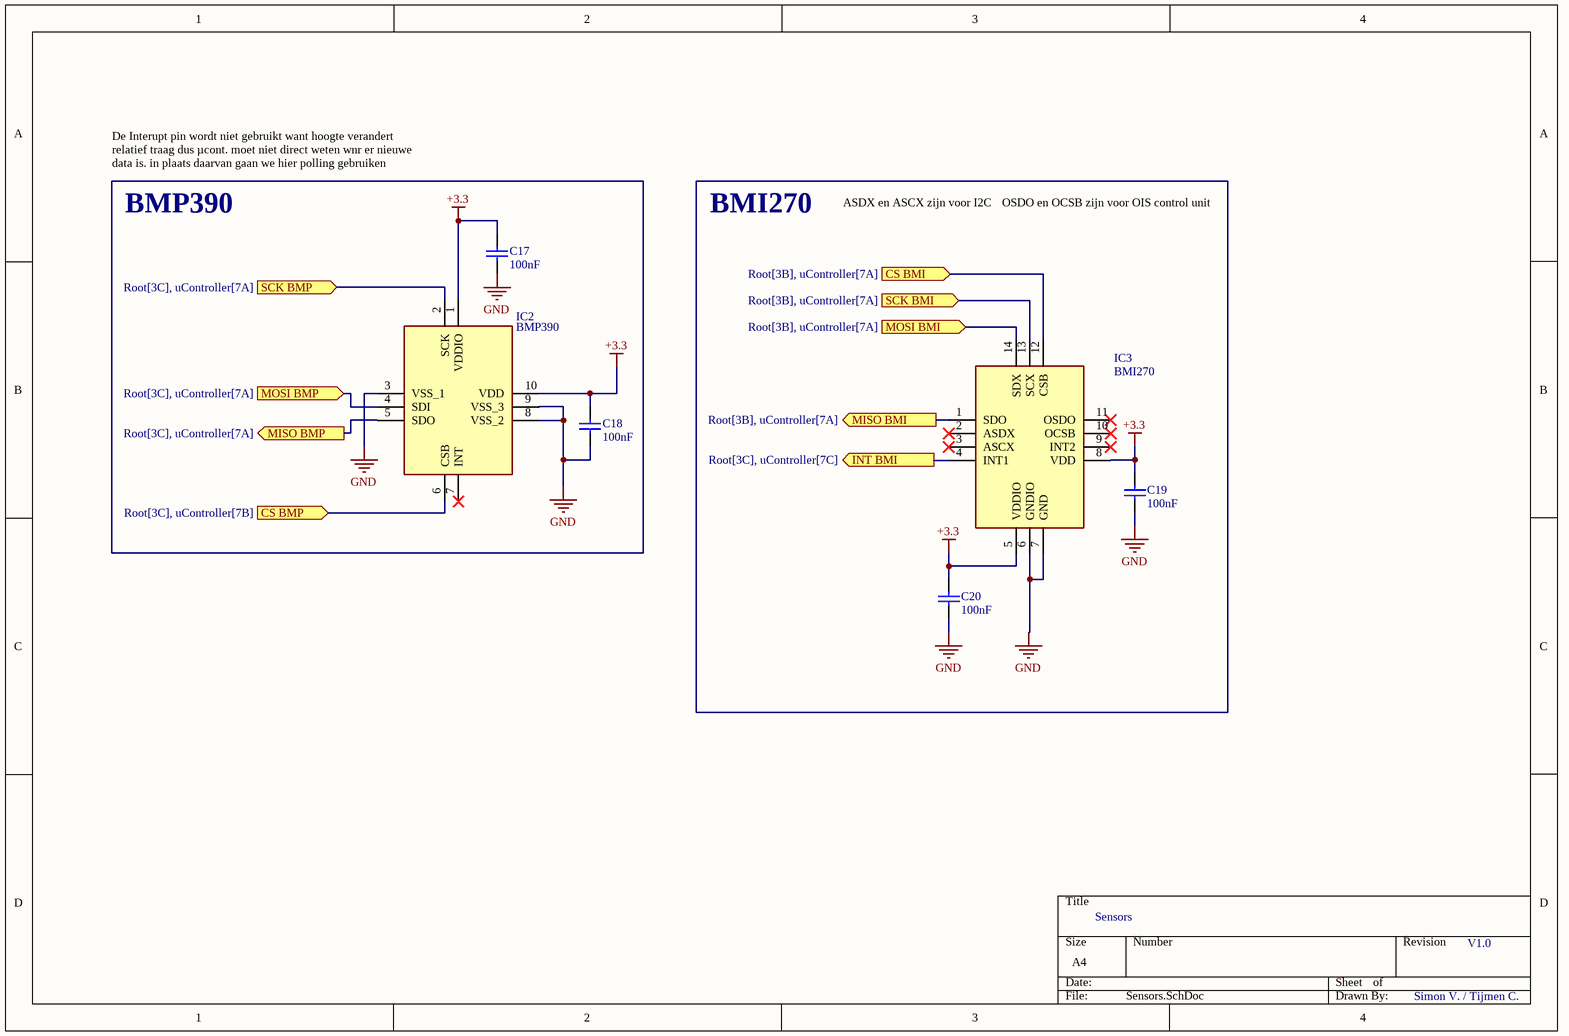
[diagram p4: Sensors.SchDoc]

### Parts
C17  100nF  [CAPC1608X92X38ML15T08]
C18  100nF  [CAPC1608X92X38ML15T08]
C19  100nF  [CAPC1608X92X38ML15T08]
C20  100nF  [CAPC1608X92X38ML15T08]
IC2  BMP390  [BMP390]
IC3  BMI270  [BMI270]

### Ports
CS BMI (in, see Root[3B], uController[7A]), CS BMP (in, see Root[3C], uController[7B]), INT BMI (out, see Root[3C], uController[7C]), MISO BMI (out, see Root[3B], uController[7A]), MISO BMP (out, see Root[3C], uController[7A]), MOSI BMI (in, see Root[3B], uController[7A]), MOSI BMP (in, see Root[3C], uController[7A]), SCK BMI (in, see Root[3B], uController[7A]), SCK BMP (in, see Root[3C], uController[7A])

### Nets
+3.3: C17.2 C18.2 C19.2 C20.2 IC2.1(VDDIO) IC2.10(VDD) IC3.5(VDDIO) IC3.8(VDD)
GND: C17.1 C18.1 C19.1 C20.1 IC2.3(VSS_1) IC2.8(VSS_2) IC2.9(VSS_3) IC3.6(GNDIO) IC3.7(GND)  [project net BAT-]
CS BMI: IC3.12(CSB) ; port CS BMI
CS BMP: IC2.6(CSB) ; port CS BMP
INT BMI: IC3.4(INT1) ; port INT BMI
MISO BMI: IC3.1(SDO) ; port MISO BMI
MISO BMP: IC2.5(SDO) ; port MISO BMP
MOSI BMI: IC3.14(SDX) ; port MOSI BMI
MOSI BMP: IC2.4(SDI) ; port MOSI BMP
SCK BMI: IC3.13(SCX) ; port SCK BMI
SCK BMP: IC2.2(SCK) ; port SCK BMP

Not connected (* = marked no-connect by the designer): IC2 7(INT)*; IC3 2(ASDX)* 3(ASCX)* 9(INT2)* 10(OCSB)* 11(OSDO)*

### Notes on the sheet
- De Interupt pin wordt niet gebruikt want hoogte verandert relatief traag dus µcont. moet niet direct weten wnr er nieuwe data is. in plaats daarvan gaan we hier polling gebruiken
- BMP390
- BMI270
- ASDX en ASCX zijn voor I2C
- OSDO en OCSB zijn voor OIS control unit
- Sensors
- V1.0
- Simon V. / Tijmen C.

### Library data of the parts
C17-C20 = CMP-2006-01140-1: as C21 on sheet Power
IC2 = BMP390: Integrated Circuit; Manufacturer_Name: BOSCH; Datasheet Link: https://www.bosch-sensortec.com/media/boschsensortec/downloads/datasheets/bst-bmp390-ds002.pdf; Height: 0.8mm; Manufacturer_Part_Number: BMP390; Mouser Part Number: 262-BMP390; Mouser Price/Stock: https://www.mouser.co.uk/ProductDetail/Bosch-Sensortec/BMP390?qs=QNEnbhJQKvYQVfvRMgo2YA%3D%3D; Arrow Part Number: BMP390; Arrow Price/Stock: https://www.arrow.com/en/products/bmp390/bosch-sensortec?utm_currency=USD&region=nac
IC3 = BMI270: Integrated Circuit; Manufacturer_Name: BOSCH; Datasheet Link: https://www.bosch-sensortec.com/media/boschsensortec/downloads/datasheets/bst-bmi270-ds000.pdf; Height: 0.87mm; Manufacturer_Part_Number: BMI270; Mouser Part Number: 262-BMI270; Mouser Price/Stock: https://www.mouser.co.uk/ProductDetail/Bosch-Sensortec/BMI270?qs=u16ybLDytRYIj%252BjQEee88A%3D%3D; Arrow Part Number: BMI270; Arrow Price/Stock: https://www.arrow.com/en/products/bmi270/bosch-sensortec?utm_currency=USD&region=europe

## Nets that join several sheets
+3.3: Power (C27.2 IC5.5 R7.2), uController (19 pins), High Freq (9 pins), Sensors (8 pins)
BAT-: Power (14 pins), uController (23 pins), High Freq (100 pins), Sensors (9 pins)
CS BMI: uController (IC1.G3), Sensors (IC3.12)
CS BMP: uController (IC1.K8), Sensors (IC2.6)
CS SX1280: uController (IC1.C3), High Freq (IC7.19)
DAN-F10N RX: uController (IC1.C9), High Freq (IC6.9)
DAN-F10N TX: uController (IC1.D10), High Freq (IC6.10)
GPS Time: uController (IC1.G2), High Freq (IC6.20)
INT BMI: uController (IC1.A2), Sensors (IC3.4)
MISO BMI: uController (IC1.J3), Sensors (IC3.1)
MISO BMP: uController (IC1.H10), Sensors (IC2.5)
MISO SX1280: uController (IC1.D3), High Freq (IC7.16)
MOSI BMI: uController (IC1.K3), Sensors (IC3.14)
MOSI BMP: uController (IC1.G10), Sensors (IC2.4)
MOSI SX1280: uController (IC1.E3), High Freq (IC7.17)
RX1280 SCK: uController (IC1.A3), High Freq (IC7.18)
SCK BMI: uController (IC1.H3), Sensors (IC3.13)
SCK BMP: uController (IC1.J8), Sensors (IC2.2)
SX1280 BUSSY: uController (IC1.H4), High Freq (IC7.7)
SX1280 nReset: uController (IC1.G4), High Freq (IC7.3)